# Altium schematic sheet 03_UI_Outputs.SchDoc: VISIBLE RGB STATUS
size A4; Author: Henrique Rosa; DrawnBy: Henq / Codex; Engineer: Henrique Rosa; Address1: rua; Address: Bairro; Address3: São Paulo, SP - Brasil; Address4: 55 (11) 9 6825-6715; DocumentNumber: GBS-03; Revision: A; SheetNumber: 04; SheetTotal: 06; Site: henq.com; VersionControl_RevNumber: 03; PageSetup: Record=PageOptions|CenterHorizontal=True|CenterVertical=True|PrintScale=0.98|XCorrection=1.00|YCorrection=1.00|PrintKind=0|BorderSize=5000000|LeftOffset=0|BottomOffset=0|Orientation=2|PaperLength=1000|PaperWidth=1000|Scale=100|PaperSource=7|PrintQuality=-3|MediaType=1|DitherType=10|PrintScaleMode=1|PaperKind=A4|PaperIndex=9
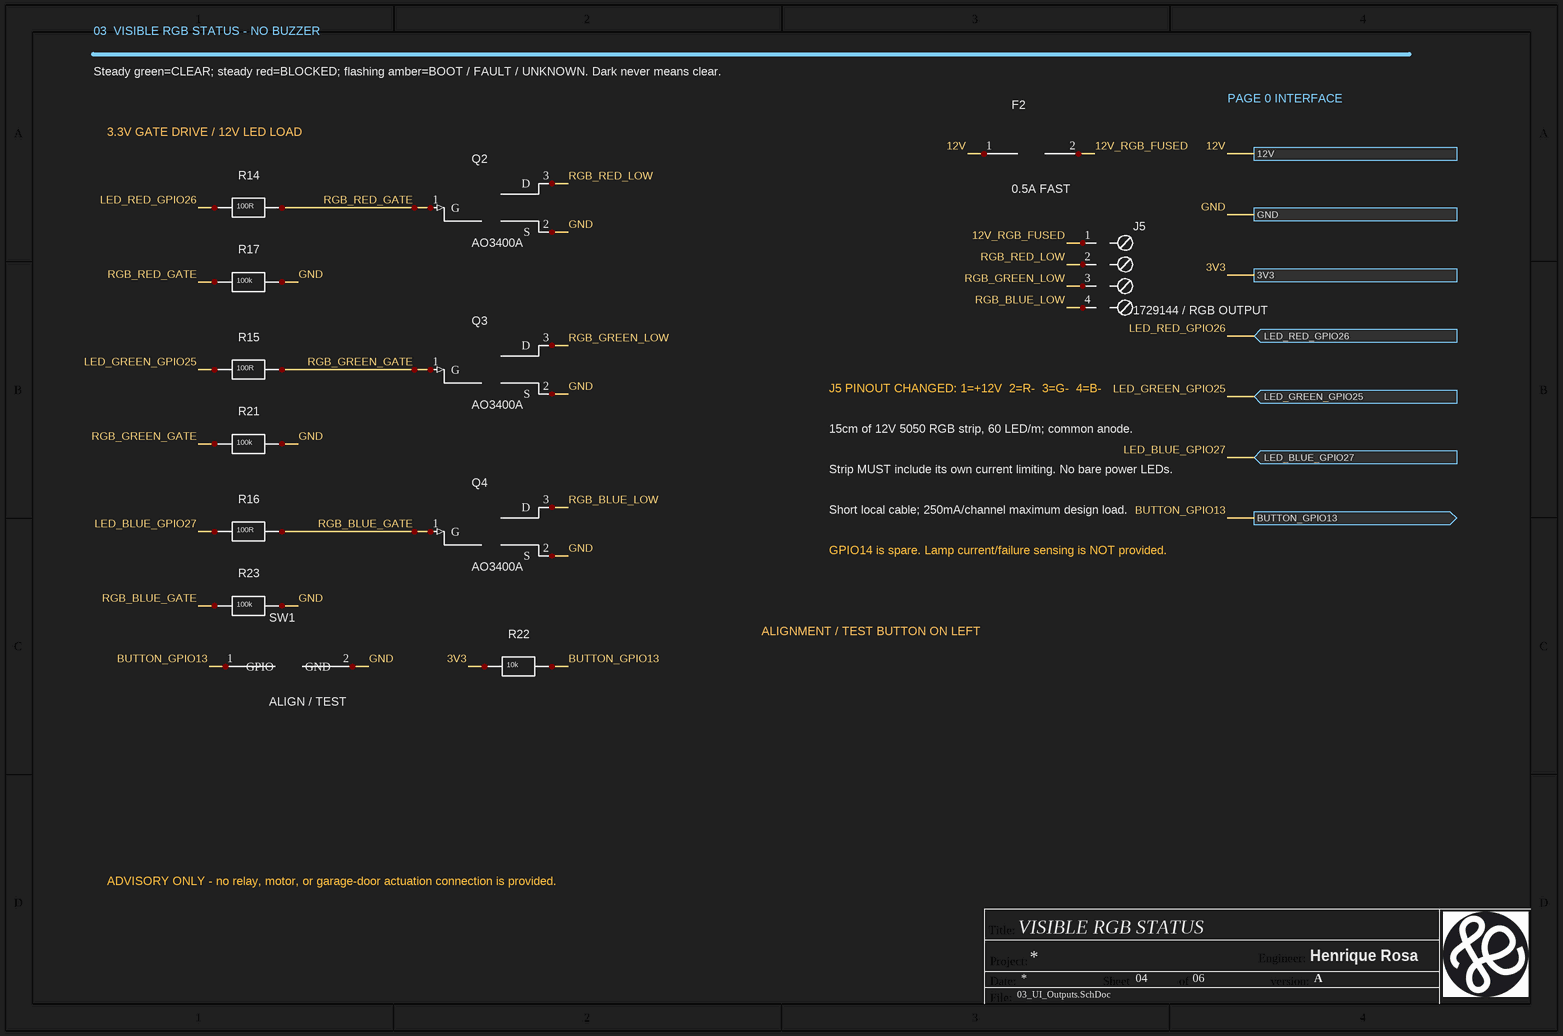
[diagram p0: 03_UI_Outputs.SchDoc]

## Parts
F2  0.5A FAST  [LITTELFUSE_0451_2410]
J5  1729144 / RGB OUTPUT  [PHOENIX_1729144_MKDSN_4_508]
Q2  AO3400A  [AO3400A_G1_S2_D3]
Q3  AO3400A  [AO3400A_G1_S2_D3]
Q4  AO3400A  [AO3400A_G1_S2_D3]
R14  100R  [YAGEO RES 0805_2012]
R15  100R  [YAGEO RES 0805_2012]
R16  100R  [YAGEO RES 0805_2012]
R17  100k  [YAGEO RES 0805_2012]
R21  100k  [YAGEO RES 0805_2012]
R22  10k  [YAGEO RES 0805_2012]
R23  100k  [YAGEO RES 0805_2012]
SW1  ALIGN / TEST  [OMRON_B3FS1000P_LOGICAL_1_2]

## Ports
3V3, 12V, BUTTON_GPIO13 (out), GND, LED_BLUE_GPIO27 (in), LED_GREEN_GPIO25 (in), LED_RED_GPIO26 (in)

## Nets
3V3: R22.1 ; port 3V3
12V: F2.1 ; port 12V
12V_RGB_FUSED: F2.2 J5.1(+12V)
BUTTON_GPIO13: R22.2 SW1.1(GPIO) ; port BUTTON_GPIO13
GND: Q2.2(S) Q3.2(S) Q4.2(S) R17.2 R21.2 R23.2 SW1.2(GND) ; port GND
LED_BLUE_GPIO27: R16.1 ; port LED_BLUE_GPIO27
LED_GREEN_GPIO25: R15.1 ; port LED_GREEN_GPIO25
LED_RED_GPIO26: R14.1 ; port LED_RED_GPIO26
RGB_BLUE_GATE: Q4.1(G) R16.2 R23.1
RGB_BLUE_LOW: J5.4(B-) Q4.3(D)
RGB_GREEN_GATE: Q3.1(G) R15.2 R21.1
RGB_GREEN_LOW: J5.3(G-) Q3.3(D)
RGB_RED_GATE: Q2.1(G) R14.2 R17.1
RGB_RED_LOW: J5.2(R-) Q2.3(D)

## Notes on the sheet
- 03  VISIBLE RGB STATUS - NO BUZZER
- Steady green=CLEAR; steady red=BLOCKED; flashing amber=BOOT / FAULT / UNKNOWN. Dark never means clear.
- PAGE 0 INTERFACE
- 3.3V GATE DRIVE / 12V LED LOAD
- J5 PINOUT CHANGED: 1=+12V  2=R-  3=G-  4=B-
- 15cm of 12V 5050 RGB strip, 60 LED/m; common anode.
- Strip MUST include its own current limiting. No bare power LEDs.
- Short local cable; 250mA/channel maximum design load.
- GPIO14 is spare. Lamp current/failure sensing is NOT provided.
- ALIGNMENT / TEST BUTTON ON LEFT
- ADVISORY ONLY - no relay, motor, or garage-door actuation connection is provided.
- Title:
- Project:
- Date:
- Sheet
- of
- Engineer:
- version:
- File:
- Title
- Size:
- A4
- Number:
- Time:
- Revision:

## Library data of the parts
F2 = *: RGB cable branch fuse; verify fault clearing with selected supply; Manufacturer: Littelfuse; Manufacturer Part Number: 0451.500MRL; Populate: Yes; CAD status: Reusable reviewed symbol; pin/pad check performed by refresh. Native ERC, PCB ECO and 3D mechanical inspection still required.; Value: 0451.500MRL; Component refresh: 2026-09-10 sourced-symbol pass; not manufacturing release; Symbol source: Celestial / Mark Harris / SCH - FUSE - MOUNTED FUSE.Schlib / MOUNTED FUSE; Symbol adaptation: Import Celestial symbol artwork; retain physical pin identities and positions; lead extensions adapt the symbol to existing wiring.; Package: FUSE_2410; Intended footprint: LITTELFUSE_0451_2410; Footprint source: Local PinRepairFootprints.PcbLib; source and polarity checked; Part Number: 0451.500MRL
J5 = *: Common-anode analogue RGB strip; NOT addressable; Manufacturer: Phoenix Contact; Populate: Yes; CAD status: Reusable reviewed symbol; pin/pad check performed by refresh. Native ERC, PCB ECO and 3D mechanical inspection still required.; Symbol provenance: Project-authored native Altium library; based on identified manufacturer part and pinout, not vendor-issued CAD; Component refresh: 2026-09-10 sourced-symbol pass; not manufacturing release; Symbol adaptation: Keep existing part-specific symbol; package and procurement metadata retained.; Manufacturer Part Number: 1729144; Package: TERM_4_508; Intended footprint: PHOENIX_1729144_MKDSN_4_508; Part Number: 1729144; Value: 1729144
Q2-Q4 = *: 30V NMOS; Rds(on) specified at Vgs=2.5V; limit load to 250mA/channel; Manufacturer: Alpha and Omega Semiconductor; Populate: Yes; CAD status: Reusable reviewed symbol; pin/pad check performed by refresh. Native ERC, PCB ECO and 3D mechanical inspection still required.; 3D asset: lib/upstream-kicad/SOT-23.step; downloaded, native link pending; Component refresh: 2026-09-10 sourced-symbol pass; not manufacturing release; Symbol source: Celestial / Mark Harris / SCH - FET - N-CH - MOSFET SINGLE GDS.SCHLIB / MOSFET SINGLE GDS; Symbol adaptation: Import Celestial symbol artwork; retain physical pin identities and positions; lead extensions adapt the symbol to existing wiring.; Manufacturer Part Number: AO3400A; Package: Package_TO_SOT_SMD:SOT-23; Intended footprint: AO3400A_G1_S2_D3; Datasheet: https://www.aosmd.com/sites/default/files/res/datasheets/AO3400A.pdf; Footprint source: Local PinRepairFootprints.PcbLib; source and polarity checked; Part Number: AO3400A; Value: AO3400A
R14-R16 = Res3: MOSFET gate series resistor; Part number: RC0805FR-07100RL; Manufacturer: Yageo; Symbol source: Project-authored IEC resistor view; exact Yageo MPN and Celestial footprint retained; CAD status: Reusable reviewed symbol; pin/pad check performed by refresh. Native ERC, PCB ECO and 3D mechanical inspection still required.; Component refresh: 2026-09-10 sourced-symbol pass; not manufacturing release; Symbol adaptation: Project-authored IEC resistor variant; retain exact Yageo part and Celestial footprint.; Valor: 100R; Manufacturer Part Number: RC0805FR-07100RL; Intended footprint: YAGEO RES 0805_2012; Footprint source: Celestial Altium Library / Mark Harris / https://altiumlibrary.com; Value: 100R
R17 R21 R23 = Res3: Gate-source pull-down; off while ESP32 resets; Part number: RC0805FR-07100KL; Manufacturer: Yageo; Symbol source: Project-authored IEC resistor view; exact Yageo MPN and Celestial footprint retained; CAD status: Reusable reviewed symbol; pin/pad check performed by refresh. Native ERC, PCB ECO and 3D mechanical inspection still required.; Component refresh: 2026-09-10 sourced-symbol pass; not manufacturing release; Symbol adaptation: Project-authored IEC resistor variant; retain exact Yageo part and Celestial footprint.; Valor: 100k; Manufacturer Part Number: RC0805FR-07100KL; Intended footprint: YAGEO RES 0805_2012; Footprint source: Celestial Altium Library / Mark Harris / https://altiumlibrary.com; Value: 100k
R22 = Res3: Test button external pull-up; Part number: RC0805FR-0710KL; Manufacturer: Yageo; Symbol source: Project-authored IEC resistor view; exact Yageo MPN and Celestial footprint retained; CAD status: Reusable reviewed symbol; pin/pad check performed by refresh. Native ERC, PCB ECO and 3D mechanical inspection still required.; Component refresh: 2026-09-10 sourced-symbol pass; not manufacturing release; Symbol adaptation: Project-authored IEC resistor variant; retain exact Yageo part and Celestial footprint.; Valor: 10k; Manufacturer Part Number: RC0805FR-0710KL; Intended footprint: YAGEO RES 0805_2012; Footprint source: Celestial Altium Library / Mark Harris / https://altiumlibrary.com; Value: 10k
SW1 = *: Momentary test switch; Manufacturer: Omron; Manufacturer Part Number: B3FS-1000P; Populate: Yes; CAD status: Reusable reviewed symbol; pin/pad check performed by refresh. Native ERC, PCB ECO and 3D mechanical inspection still required.; Value: B3FS-1000P; Component refresh: 2026-09-10 sourced-symbol pass; not manufacturing release; Symbol source: Celestial / Mark Harris / SCH - SWITCH - SPST 2PIN.SCHLIB / SPST 2PIN; Symbol adaptation: Import Celestial symbol artwork; retain physical pin identities and positions; lead extensions adapt the symbol to existing wiring.; Package: SW_SMD_6X6; Intended footprint: OMRON_B3FS1000P_LOGICAL_1_2; Footprint source: Local PinRepairFootprints.PcbLib; source and polarity checked; Part Number: B3FS-1000P